# EAGLE schematic plant long life v1.00 (EAGLE 7.6.0)
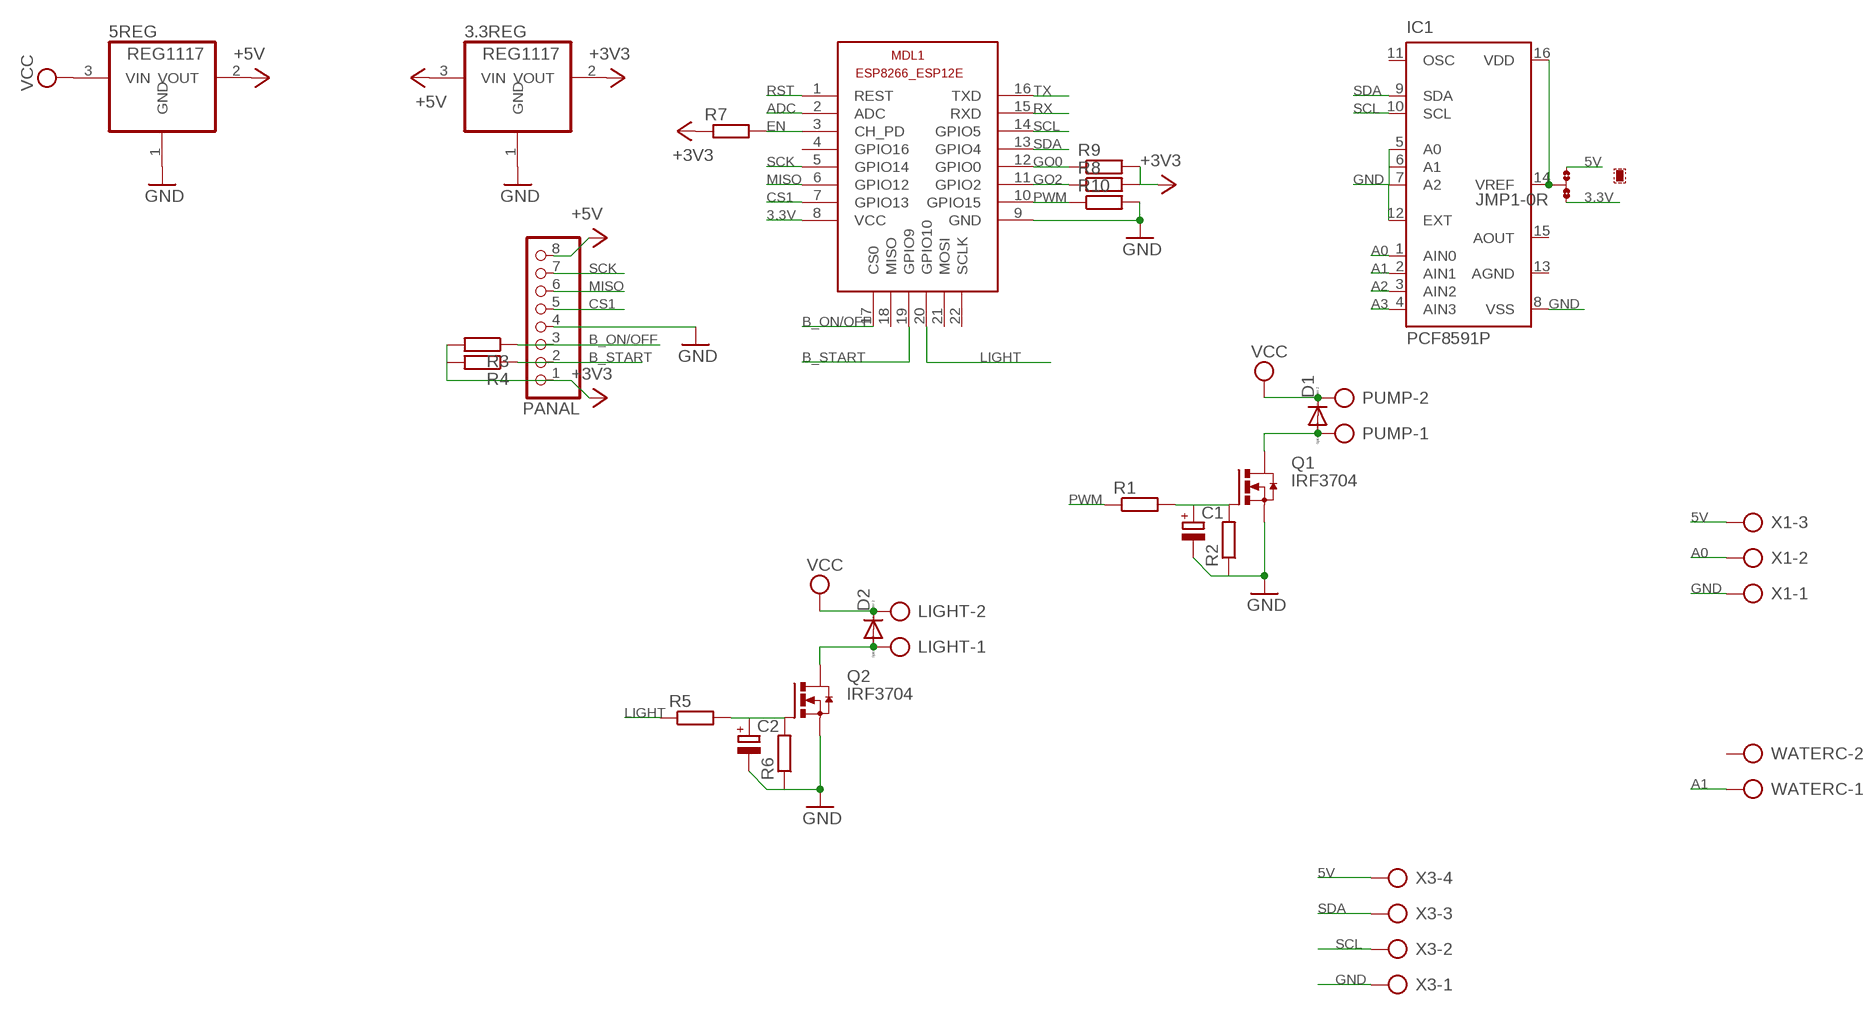
[diagram p0: schematic, sheet 1]

## Parts
3.3REG  REG1117  [SOT223]
5REG  REG1117  [SOT223]
C1  CPOL-EUSMCA  [SMC_A]
C2  CPOL-EUSMCA  [SMC_A]
D1  DIODE-SMC  [SMC]
D2  DIODE-SMC  [SMC]
IC1  PCF8591P  [DIL16]
JMP1  0R-JUMPA  [A0R-JMP]
LIGHT  AK300/2  [AK300/2]
MDL1  ESP8266-12EESP8266-ESP12E  [ESP8266-ESP12E]
PANAL  PINHD-1X8  [1X08]
PUMP  AK300/2  [AK300/2]
Q1  IRF3704  [TO220AH]
Q2  IRF3704  [TO220AH]
R1  R-EU_R0805  [R0805]
R2  R-EU_R0805  [R0805]
R3  R-EU_R0805  [R0805]
R4  R-EU_R0805  [R0805]
R5  R-EU_R0805  [R0805]
R6  R-EU_R0805  [R0805]
R7  R-EU_R0805  [R0805]
R8  R-EU_R0805  [R0805]
R9  R-EU_R0805  [R0805]
R10  R-EU_R0805  [R0805]
WATERC  AK300/2  [AK300/2]
X1  AK500/3  [AK500/3]
X3  AK500/4  [AK500/4]

## Nets
3.3V: JMP1.1 MDL1.8(VCC)
5V: JMP1.3 X1.3 X3.4
+3V3: 3.3REG.2(VOUT) PANAL.1 R3.2 R4.2 R7.1 R8.2 R9.2
+5V: 3.3REG.3(VIN) 5REG.2(VOUT) PANAL.8
A0: IC1.1(AIN0) X1.2
A1: IC1.2(AIN1) WATERC.1
A2: IC1.3(AIN2)
A3: IC1.4(AIN3)
ADC: MDL1.2(ADC)
B_ON/OFF: MDL1.17(CS0) PANAL.3 R3.1
B_START: MDL1.19(GPIO9) PANAL.2 R4.1
CS1: MDL1.7(GPIO13) PANAL.5
EN: MDL1.3(CH_PD) R7.2
GND: 3.3REG.1(GND) 5REG.1(GND) C1.- C2.- IC1.5(A0) IC1.6(A1) IC1.7(A2) IC1.8(VSS) IC1.12(EXT) MDL1.9(GND) PANAL.4 Q1.E(S) Q2.E(S) R2.1 R6.1 R10.2 X1.1 X3.1
GO0: MDL1.12(GPIO0) R9.1
GO2: MDL1.11(GPIO2) R8.1
LIGHT: MDL1.20(GPIO10) R5.1
MISO: MDL1.6(GPIO12) PANAL.6
N$1: D1.A PUMP.1 Q1.C(D)
N$2: C1.+ Q1.B(G) R1.2 R2.2
N$3: D2.A LIGHT.1 Q2.C(D)
N$6: C2.+ Q2.B(G) R5.2 R6.2
PWM: MDL1.10(GPIO15) R1.1 R10.1
RST: MDL1.1(REST)
RX: MDL1.15(RXD)
SCK: MDL1.5(GPIO14) PANAL.7
SCL: IC1.10(SCL) MDL1.14(GPIO5) X3.2
SDA: IC1.9(SDA) MDL1.13(GPIO4) X3.3
SELC: IC1.14(VREF) IC1.16(VDD) JMP1.2
TX: MDL1.16(TXD)
VCC: 5REG.3(VIN) D1.C D2.C LIGHT.2 PUMP.2
Unconnected: IC1.11(OSC) IC1.15(AOUT) MDL1.4(GPIO16) MDL1.18(MISO) MDL1.21(MOSI) MDL1.22(SCLK) WATERC.2

## Power pins joined to a net without a drawn wire
AGND: IC1.13(AGND)

## Library data of the parts
3.3REG 5REG = burr-brown:REG1117: 800mA and 1A Low Dropout (LDO) Positive Regulator 1.8V, 2.5V, 2.85V, 3.3V, 5V, and Adj; MPN: REG1117; OC_FARNELL: 1097566; OC_NEWARK: 14P6981
C1 C2 = resistor:CPOL-EU: POLARIZED CAPACITOR, European symbol
D1 D2 = diode:DIODE-: DIODE
IC1 = micro-philips:PCF8591: I2C-Bus D/A CONVERTER; MF: FARNELL; MPN: PCF8591P; OC_FARNELL: 396412; OC_NEWARK: 07WX3385
JMP1 = jump-0r-smd:0R-JUMP: SMD 0R 0805 Jumper
LIGHT PUMP WATERC = con-ptr500:AK300/2: CONNECTOR; OC_FARNELL: unknown; OC_NEWARK: unknown
MDL1 = ESP8266-ESP12E:ESP8266-12E: ESP8266-12E with additional I/O and GPIO04/05 corrected The author cannot warrant that this library is free from error or will meet your specific requirements. Created by PuceBaboon.com. Komagane, Nagano, JAPAN
PANAL = pinhead:PINHD-1X8: PIN HEADER
Q1 Q2 = transistor-power:IRF3704: SMPS MOSFET HEXFET® Power MOSFET Source: http://www.irf.com/product-info/datasheets/data/irf3704.pdf
R1-R10 = rcl:R-EU_: RESISTOR, European symbol
X1 = con-ptr500:AK500/3: CONNECTOR; OC_FARNELL: unknown; OC_NEWARK: unknown
X3 = con-ptr500:AK500/4: CONNECTOR; OC_FARNELL: unknown; OC_NEWARK: unknown